# Altium schematic sheet eBox_Power.SchDoc: eBox_Power
size A4; DocumentNumber: 2; SheetNumber: 2; SheetTotal: 9
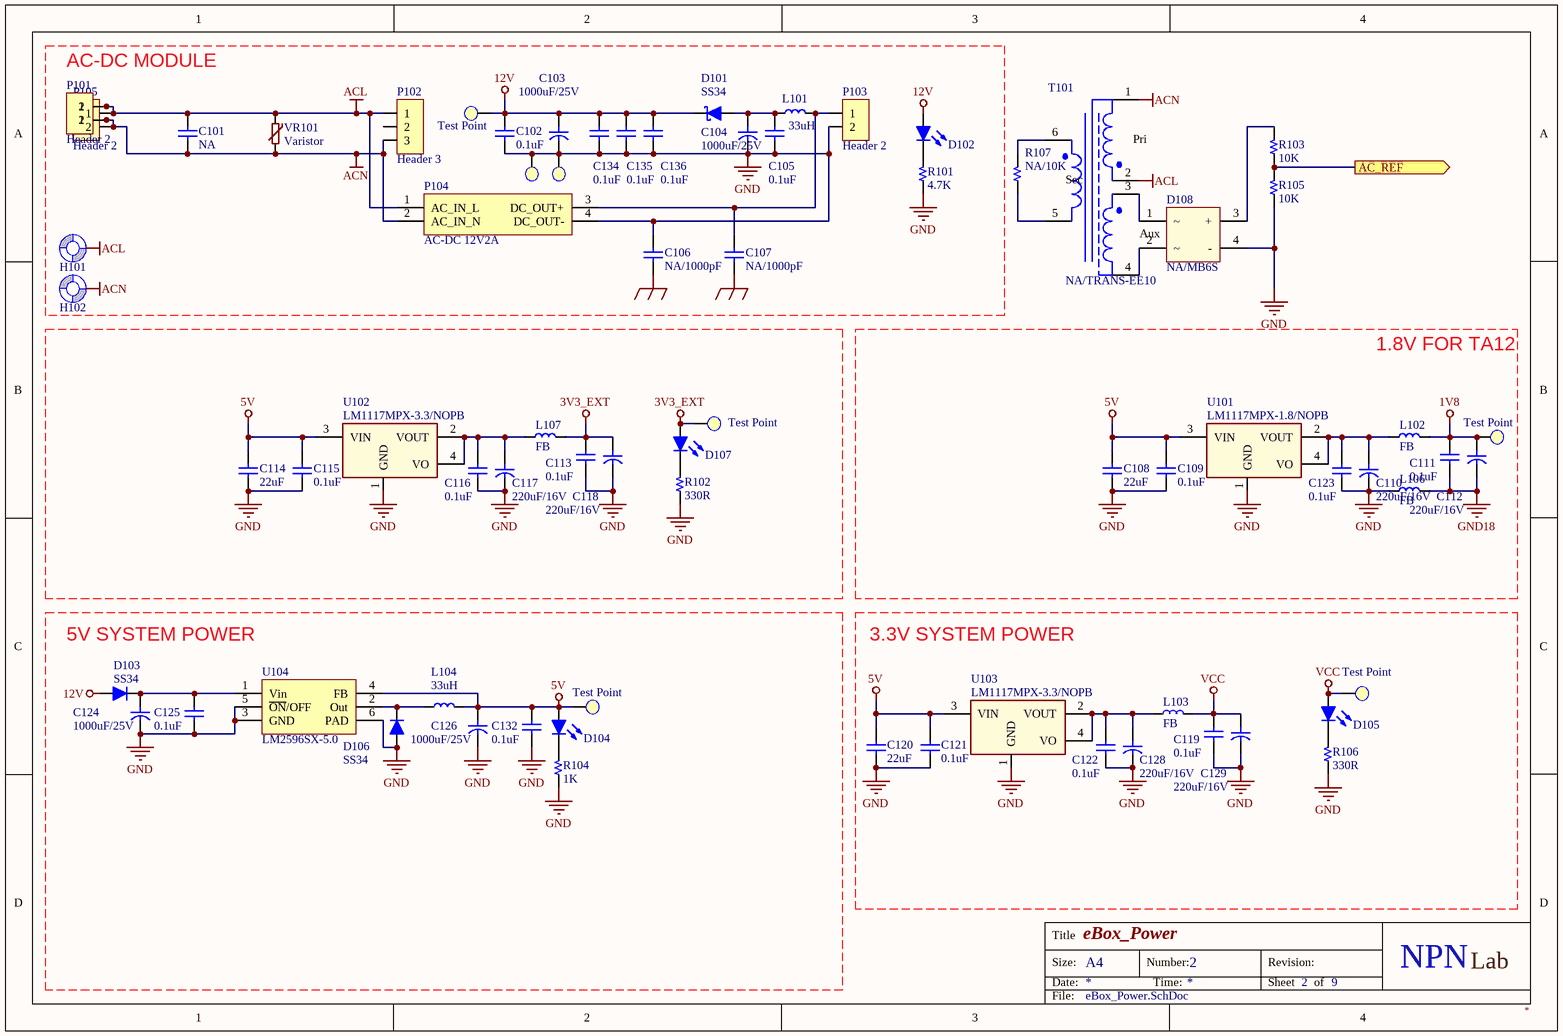
[diagram p0: eBox_Power.SchDoc]

## Parts
1V8  Test Point  [TestPoint/SMD/1.5mm]  (no BOM)
3V3EXT  Test Point  [TestPoint/SMD/1.5mm]  (no BOM)
5V  Test Point  [TestPoint/SMD/1.5mm]  (no BOM)
12V  Test Point  [TestPoint/SMD/1.5mm]  (no BOM)
C101  NA  [CAP Ceramic/D7.0/F7.5]
C102  0.1uF  [C 0805]
C103  1000uF/25V  [CAP/D100/H200/LS50]
C104  1000uF/25V  [CAP/D100/H200/LS50]
C105  0.1uF  [C 0805]
C106  NA/1000pF  [CAP Ceramic/W300]
C107  NA/1000pF  [CAP Ceramic/W300]
C108  22uF  [C 1210 mix 0805]
C109  0.1uF  [C 0805]
C110  220uF/16V  [CYL/D.250/LS.100-D63H70P25]
C111  0.1uF  [C 0805]
C112  220uF/16V  [CYL/D.250/LS.100-D63H70P25]
C113  0.1uF  [C 0805]
C114  22uF  [C 1210 mix 0805]
C115  0.1uF  [C 0805]
C116  0.1uF  [C 0805]
C117  220uF/16V  [CYL/D.250/LS.100-D63H70P25]
C118  220uF/16V  [CYL/D.250/LS.100-D63H70P25]
C119  0.1uF  [C 0805]
C120  22uF  [C 1210 mix 0805]
C121  0.1uF  [C 0805]
C122  0.1uF  [C 0805]
C123  0.1uF  [C 0805]
C124  1000uF/25V  [CAP/D100/H200/LS50]
C125  0.1uF  [C 0805]
C126  1000uF/25V  [CAP/D100/H200/LS50]
C128  220uF/16V  [CYL/D.250/LS.100-D63H70P25]
C129  220uF/16V  [CYL/D.250/LS.100-D63H70P25]
C132  0.1uF  [C 0805]
C134  0.1uF  [C 0805]
C135  0.1uF  [C 0805]
C136  0.1uF  [C 0805]
D101  SS34  [DO-214AB (SMC)]
D102  LED RED 3MM  [LED 3MM - red]  (value not drawn)
D103  SS34  [DO-214AC (SMA) L]
D104  LED RED 3MM  [LED 3MM - red]  (value not drawn)
D105  LED RED 3MM  [LED 3MM - red]  (value not drawn)
D106  SS34  [DO-214AC (SMA) L]
D107  LED RED 3MM  [LED 3MM - red]  (value not drawn)
D108  NA/MB6S  [DiodeBridge-SOIC4]
GND2  Test Point  [TESTPOINT/1/Black]  (value not drawn)  (no BOM)
GND3  Test Point  [TESTPOINT/1/Black]  (value not drawn)  (no BOM)
H101  Screw Hole  [SCREW/3.0/6.0]  (value not drawn)  (no BOM)
H102  Screw Hole  [SCREW/3.0/6.0]  (value not drawn)  (no BOM)
L101  33uH  [Inductor SMD 6.5x6.5x3.0]  (no BOM)
L102  FB  [L 0805 (2012)]
L103  FB  [L 0805 (2012)]
L104  33uH  [Inductor SMD 12x12x8]
L105  33uH  [Inductor SMD 12x12x8]  (value not drawn)
L106  FB  [L 0805 (2012)]
L107  FB  [L 0805 (2012)]
P101  Header 2  [HDR/Terminal/2/KF55C-10]
P102  Header 3  [HDR/Header/3/VH]
P103  Header 2  [HDR/Header/2/VH]
P104  AC-DC 12V2A  [AC-DC 12V2A]
P105  Header 2  [HDR/Terminal/2/KF1000]  (no BOM)
P106  Header 2  [HDR/Terminal/2/KF1000]  (value not drawn)  (no BOM)
R101  4.7K  [R 0603]
R102  330R  [R 0603]
R103  10K  [R 0805]
R104  1K  [R 0603]
R105  10K  [R 0805]
R106  330R  [R 0603]
R107  NA/10K  [R 0805]
T101  NA/TRANS-EE10  [Trans. EE10/6P/F]
U101  LM1117MPX-1.8/NOPB  [SOT-223]
U102  LM1117MPX-3.3/NOPB  [SOT-223]
U103  LM1117MPX-3.3/NOPB  [SOT-223]
U104  LM2596SX-5.0  [TO-263-6]
VCC  Test Point  [TestPoint/SMD/1.5mm]  (no BOM)
VR101  Varistor  [VARISTOR DISC 5MM/7MM]

## Ports
AC_REF (out)

## Nets
1V8: 1V8.1(TP) C111.1 C112.1 L102.2
3V3_EXT: 3V3EXT.1(TP) C113.1 C118.1 D107.1(A) L107.2
5V: 5V.1(TP) C108.1 C109.1 C114.1 C115.1 C120.1 C121.1 C126.1 C132.1 D104.1(A) L104.2 U101.3(VIN) U102.3(VIN) U103.3(VIN) U104.4(FB)
12V: 12V.1(TP) C102.1 C103.1 C134.1 C135.1 C136.1 D101.2(K) D102.1(A) D103.1(A)
ACL: C101.1 H101.1(Screw) P101.1 P102.1 P104.1(AC_IN_L) P105.1 P106.2 T101.2(A2) VR101.2
ACN: C101.2 H102.1(Screw) P101.2 P102.3 P104.2(AC_IN_N) P105.2 P106.1 T101.1(A1) VR101.1
GND: C102.2 C103.2 C104.2 C105.2 C106.1 C108.2 C109.2 C110.2 C113.2 C114.2 C115.2 C116.2 C117.2 C118.2 C119.2 C120.2 C121.2 C122.2 C123.2 C124.2 C125.2 C126.2 C128.2 C129.2 C132.2 C134.2 C135.2 C136.2 D106.1(A) D108.4(-) GND2.1(TP) GND3.1(TP) L106.1 P103.2 P104.4(DC_OUT-) R101.1 R102.1 R104.1 R105.1 R106.1 U101.1(GND) U102.1(GND) U103.1(GND) U104.3(GND) U104.5(~{ON}/OFF) U104.6(PAD)
GND18: C111.2 C112.2 L106.2
GNDEARTH: C106.2 C107.2
VCC: C119.1 C129.1 D105.1(A) L103.2 VCC.1(TP)
AC_REF: R103.1 R105.2 ; port AC_REF
NetC104_1: C104.1 C105.1 D101.1(A) L101.1 L105.1
NetC107_1: C107.1 L101.2 L105.2 P103.1 P104.3(DC_OUT+)
NetC110_1: C110.1 C123.1 L102.1 U101.2(VOUT) U101.4(VO)
NetC116_1: C116.1 C117.1 L107.1 U102.2(VOUT) U102.4(VO)
NetC122_1: C122.1 C128.1 L103.1 U103.2(VOUT) U103.4(VO)
NetC124_1: C124.1 C125.1 D103.2(K) U104.1(Vin)
NetD102_2: D102.2(K) R101.2
NetD104_2: D104.2(K) R104.2
NetD105_2: D105.2(K) R106.2
NetD106_2: D106.2(K) L104.1 U104.2(Out)
NetD107_2: D107.2(K) R102.2
NetD108_1: D108.1 T101.3(B1)
NetD108_2: D108.2 T101.4(B2)
NetD108_3: D108.3(+) R103.2
NetR107_1: R107.1 T101.5(C2)
NetR107_2: R107.2 T101.6(C1)

Not connected (* = marked no-connect by the designer): P102 2

## Notes on the sheet
- AC-DC MODULE
- 1.8V FOR TA12
- 5V SYSTEM POWER
- 3.3V SYSTEM POWER
- Title
- Size:
- Date:
- A4
- Number:
- Time:
- Revision:
- Sheet
- of
- NPN
- Lab
- File:
- (in symbol Trans 6-PIN) Pri; Sec; Aux

## Library data of the parts
C101 = Capacitor NP: Capacitor non-pol; TYPE: NA
C102 C105 C109 C111 C113 C115 C116 C119 C121-C123 C125 C132 C134-C136 = Capacitor NP: CAP CER 0.1UF 50V X7R 0805; TYPE: SMD; PACKAGE: SMD0805; STOCK CODE: CL21B104KBNC; SUPPLIER: tme.vn; STOCK DESC: 100nF/50V ±10% X7R SMD-0805 Capacitor; UNIT PRICE: 400
C103 C104 C124 C126 = Capacitor: CAP ALUM 1000UF 20% 25V RADIAL; BRAND: JWCO; TYPE: TH; PACKAGE: 10x17mm; STOCK CODE: 1000uF/25V; SUPPLIER: tme.vn; STOCK DESC: 1000uF/25V ±20% Aluminum Electrolytic Capacitor, Size 10x17mm; UNIT PRICE: 3000
C106 C107 = Capacitor NP: Capacitor non-pol; TYPE: NA
C108 C114 C120 = Capacitor NP: CAP CER 22UF 10% 16V X7R 1210; TYPE: SMD; PACKAGE: SMD1210; STOCK CODE: CC1210KKX7R7BB226; SUPPLIER: tme.vn; STOCK DESC: 22uF/16V ±10% X7R SMD-1210 Capacitor; UNIT PRICE: 2500
C110 C112 C117 C118 C128 C129 = Capacitor: CAP ALUM 220UF 20% 16V RADIAL; TYPE: TH; PACKAGE: 6.3x12; STOCK CODE: 220uF/16V; SUPPLIER: tme.vn; STOCK DESC: 220uF/16V ±20% Aluminum Electrolytic Capacitor, Size 6.3x12mm; UNIT PRICE: 900
D101 = Diode Schottky: DIODE SCHOTTKY 40V 3A SUB SMA; BRAND: Toshiba; TYPE: SMD; PACKAGE: DO-214AC; PART NO: SS34; STOCK CODE: SS34; SUPPLIER: tme.vn; STOCK DESC: 3A 40V Schottky Barrier Diode; UNIT PRICE: 2000
D102 D104 D105 D107 = Led: LED RED DIFFUSED 3MM ROUND T/H; TYPE: TH; PACKAGE: 3MM; STOCK CODE: HT204SURD; SUPPLIER: tme.vn; STOCK DESC: 3mm Base LED; UNIT PRICE: 300
D103 D106 = Diode: DIODE SCHOTTKY 40V 3A SUB SMA; BRAND: Toshiba; TYPE: SMD; PACKAGE: DO-214AC; PART NO: SS34; STOCK CODE: SS34; SUPPLIER: tme.vn; STOCK DESC: 3A 40V Schottky Barrier Diode; UNIT PRICE: 2000
D108 = DIODE BRIDGE: BRIDGE RECT 1P 600V 500MA 4SOIC; pin to pad: 1>3 2>4 3>1 4>2; PART NO: MB6S; TYPE: NA; PACKAGE: MBS (TO-269AA); STOCK CODE: MB6S
L101 = Inductor: FIXED IND 33UH 3A 105 MOHM SMD; TYPE: NO-BOM; UNIT PRICE: 0
L102 L103 L106 L107 = Inductor: Chip Ferrite Bead; TYPE: SMD; PACKAGE: SMD0805; STOCK CODE: CB2012D300ST(F); SUPPLIER: tme.vn; STOCK DESC: 30 Ohm SMD-0805 Chip Ferrite Bead; UNIT PRICE: 500
L104 L105 = Inductor: FIXED IND 33UH 3A 64.8 MOHM SMD; PACKAGE: SMD121208; SUPPLIER: tme.vn; TYPE: SMD; UNIT PRICE: 9000
P101 P103 P105 P106 = Header 2: Header, 2-Pin
  P101: TYPE: NA
  P103: TYPE: NA; UNIT PRICE: 0
  P105 P106: TYPE: NO-BOM
P102 = Header 3: Header, 3-Pin; TYPE: NA; UNIT PRICE: 0
P104 = AC-DC 12V3A: AC-DC 12V2A MODULE; SUPPLIER: CHINA; TYPE: TH; UNIT PRICE: 558676
R101 = Resistor: RES SMD 4.7K OHM 1% 1/10W 0603; PACKAGE: SMD0603; STOCK CODE: RM06JTN472; SUPPLIER: tme.vn; TYPE: SMD; STOCK DESC: 4.7K ±5% SMD-0603 Resistor; UNIT PRICE: 50
R102 R106 = Resistor: RES SMD 330 OHM 1% 1/10W 0603; PACKAGE: SMD0603; STOCK CODE: RM06JTN331; SUPPLIER: tme.vn; TYPE: SMD; STOCK DESC: 330R ±5% SMD-0603 Resistor; UNIT PRICE: 50
R103 R105 = Resistor: RES SMD 10K OHM 1% 1/8W 0805; PACKAGE: SMD0805; STOCK CODE: RM10JTN103; SUPPLIER: tme.vn; TYPE: SMD; STOCK DESC: 10K ±5% SMD-0805 Resistor; UNIT PRICE: 50
R104 = Resistor: RES SMD 1K OHM 1% 1/10W 0603; PACKAGE: SMD0603; STOCK CODE: RM06JTN102; SUPPLIER: tme.vn; TYPE: SMD; STOCK DESC: 1K ±5% SMD-0603 Resistor; UNIT PRICE: 50
R107 = Resistor: RES SMD 10K OHM 5% 1/8W 0805; PACKAGE: SMD0805; STOCK CODE: RM06JTN472; SUPPLIER: tme.vn; TYPE: SMD; STOCK DESC: 4.7K ±5% SMD-0603 Resistor; UNIT PRICE: 50
T101 = Trans 6-PIN: Transformer 6-PIN; TYPE: NA; UNIT PRICE: 5500
U101 = AMS1117: IC REG LINEAR 1.8V 800MA SOT223; BRAND: AMS; PACKAGE: SOT-223; STOCK CODE: AMS1117-1.8; SUPPLIER: tme.vn; TYPE: SMD; STOCK DESC: 1.8V 1A Low-dropout Linear Regulator; UNIT PRICE: 4000
U102 U103 = AMS1117: IC REG LINEAR 3.3V 800MA SOT223; BRAND: AMS; PACKAGE: SOT-223; STOCK CODE: AMS1117-3.3; SUPPLIER: tme.vn; TYPE: SMD; STOCK DESC: 3.3V 1A Low-dropout Linear Regulator; UNIT PRICE: 4000
U104 = LM2576SX-5.0: IC REG BUCK 5V 3A TO263-5; PART NO: LM2576SX-5.0/NOPB; BRAND: TI; PACKAGE: TO-263-6; STOCK CODE: LM2576SX-5.0/NOPBCT-ND; SUPPLIER: Digi-Key; TYPE: SMD; STOCK DESC: IC REG BUCK 5V 3A TO263-5; UNIT PRICE: 64445
1V8 3V3EXT 5V 12V GND2 GND3 VCC = Test Point: TYPE: NO-BOM; UNIT PRICE: 0
H101 H102 = Screw Hole: TYPE: NO-BOM; UNIT PRICE: 0
VR101 = Varistor: TYPE: NA; UNIT PRICE: 0